# EAGLE design nano_ieee488_v1.0b (EAGLE 6.4)
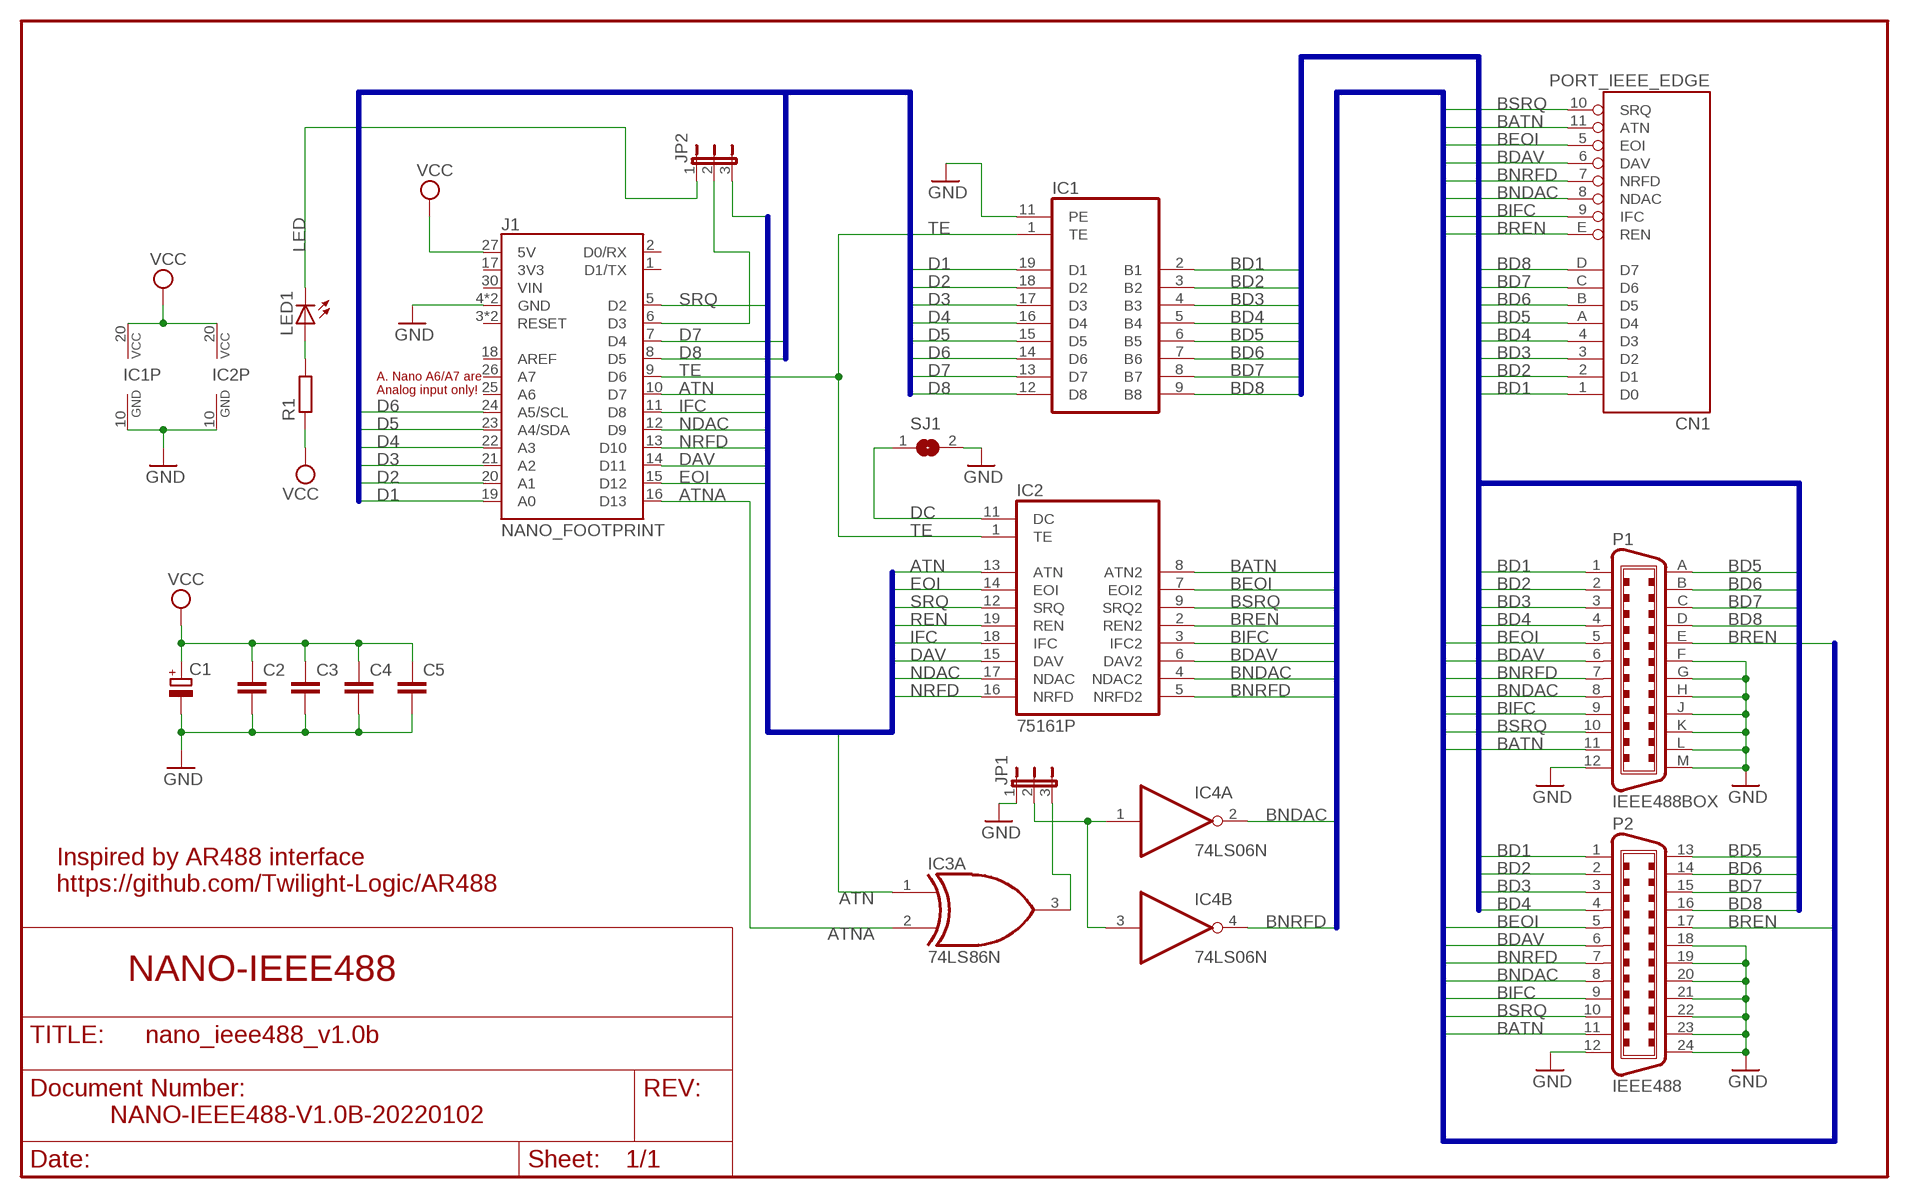
[diagram p0: schematic, sheet 1]

## Parts
C1  CPOL-EUE2.5-7  [E2,5-7]
C2  C-EU025-025X050  [C025-025X050]
C3  C-EU025-025X050  [C025-025X050]
C4  C-EU025-025X050  [C025-025X050]
C5  C-EU025-025X050  [C025-025X050]
CN1  PORT_IEEE_EDGE  [MA156_12-2_IEEE]
IC1  75160P  [DIL20]
IC2  75161P  [DIL20]
IC3  74LS86N  [DIL14]
IC4  74LS06N  [DIL14]
J1  NANO_FOOTPRINT  [NANO]
JP1  JP2E  [JP2]
JP2  JP2E  [JP2]
LED1  LED3MM  [LED3MM]
P1  IEEE488BOX  [FLAT24BOX]
P2  IEEE488  [24HP]
R1  R-EU_0204/5  [0204/5]
SJ1  SJW  [SJW]

## Nets
ATN: IC2.13(ATN) IC3.1(A:I0) J1.10(D7)
ATNA: IC3.2(A:I1) J1.16(D13)
BATN: CN1.11(ATN) IC2.8(ATN2) P1.11 P2.11
BD1: CN1.1(D0) IC1.2(B1) P1.1 P2.1
BD2: CN1.2(D1) IC1.3(B2) P1.2 P2.2
BD3: CN1.3(D2) IC1.4(B3) P1.3 P2.3
BD4: CN1.4(D3) IC1.5(B4) P1.4 P2.4
BD5: CN1.A(D4) IC1.6(B5) P1.A P2.13
BD6: CN1.B(D5) IC1.7(B6) P1.B P2.14
BD7: CN1.C(D6) IC1.8(B7) P1.C P2.15
BD8: CN1.D(D7) IC1.9(B8) P1.D P2.16
BDAV: CN1.6(DAV) IC2.6(DAV2) P1.6 P2.6
BEOI: CN1.5(EOI) IC2.7(EOI2) P1.5 P2.5
BIFC: CN1.9(IFC) IC2.3(IFC2) P1.9 P2.9
BNDAC: CN1.8(NDAC) IC2.4(NDAC2) IC4.2(A:O) P1.8 P2.8
BNRFD: CN1.7(NRFD) IC2.5(NRFD2) IC4.4(B:O) P1.7 P2.7
BREN: CN1.E(REN) IC2.2(REN2) P1.E P2.17
BSRQ: CN1.10(SRQ) IC2.9(SRQ2) P1.10 P2.10
D1: IC1.19(D1) J1.19(A0)
D2: IC1.18(D2) J1.20(A1)
D3: IC1.17(D3) J1.21(A2)
D4: IC1.16(D4) J1.22(A3)
D5: IC1.15(D5) J1.23(A4/SDA)
D6: IC1.14(D6) J1.24(A5/SCL)
D7: IC1.13(D7) J1.7(D4)
D8: IC1.12(D8) J1.8(D5)
DAV: IC2.15(DAV) J1.14(D11)
DC: IC2.11(DC) SJ1.1
EOI: IC2.14(EOI) J1.15(D12)
GND: C1.- C2.2 C3.2 C4.2 C5.2 IC1.10(GND) IC1.11(PE) IC2.10(GND) J1.4(GND) J1.29(GND) JP1.1 P1.12 P1.F P1.G P1.H P1.J P1.K P1.L P1.M P2.12 P2.18 P2.19 P2.20 P2.21 P2.22 P2.23 P2.24 SJ1.2
IFC: IC2.18(IFC) J1.11(D8)
LED: JP2.1 LED1.K(C)
N$1: IC3.3(A:O) JP1.3
N$2: IC4.1(A:I) IC4.3(B:I) JP1.2
N$3: LED1.A R1.2
N$4: J1.6(D3) JP2.2
NDAC: IC2.17(NDAC) J1.12(D9)
NRFD: IC2.16(NRFD) J1.13(D10)
REN: IC2.19(REN) JP2.3
SRQ: IC2.12(SRQ) J1.5(D2)
TE: IC1.1(TE) IC2.1(TE) J1.9(D6)
VCC: C1.+ C2.1 C3.1 C4.1 C5.1 IC1.20(VCC) IC2.20(VCC) J1.27(5V) R1.1
Unconnected: IC3.4(B:I0) IC3.5(B:I1) IC3.6(B:O) IC3.8(C:O) IC3.9(C:I0) IC3.10(C:I1) IC3.11(D:O) IC3.12(D:I0) IC3.13(D:I1) IC4.5(C:I) IC4.6(C:O) IC4.8(D:O) IC4.9(D:I) IC4.10(E:O) IC4.11(E:I) IC4.12(F:O) IC4.13(F:I) J1.1(D1/TX) J1.2(D0/RX) J1.3(RESET) J1.17(3V3) J1.18(AREF) J1.25(A6) J1.26(A7) J1.28(RESET) J1.30(VIN)

## Buses
D[1..8]
ATN,EOI,SRQ,REN,IFC,DAV,NDAC,NRFD
BD[1..8]
BATN,BEOI,BSRQ,BREN,BIFC,BDAV,BNDAC,BNRFD

## Notes on the sheet
- A. Nano A6/A7 are
  Analog input only!
- Inspired by AR488 interface
  https://github.com/Twilight-Logic/AR488
- NANO-IEEE488
- NANO-IEEE488-V1.0B-20220102

## Power pins joined to a net without a drawn wire
GND: CN1.12(GND) CN1.F(GND) CN1.H(GND) CN1.J(GND) CN1.K(GND) CN1.L(GND) CN1.M(GND) CN1.N(GND) IC3.7(P:GND) IC4.7(P:GND)
VCC: IC3.14(P:VCC) IC4.14(P:VCC)

## Library data of the parts
C1 = rcl:CPOL-EU: POLARIZED CAPACITOR, European symbol
C2-C5 = rcl:C-EU: CAPACITOR, European symbol
CN1 = commodore:PORT_IEEE_EDGE: IEEE connector for various Commodore computers, PET/CBM type, edge version
IC1 = 751xx:75160: 75xxx DEVICE
IC2 = 751xx:75161: 75xxx DEVICE
IC3 = 74xx-us:74*86: Quad 2-input EXCLUSIV-OR (XOR) gate
IC4 = 74xx-us:74*06: Hex INVERTER, open collector high-voltage output
J1 = SparkFun-Boards:NANO_FOOTPRINT: Generic Nano Footprint
JP1 JP2 = jumper:JP2E: JUMPER
LED1 = led:LED: LED OSRAM: - CHIPLED LG R971, LG N971, LY N971, LG Q971, LY Q971, LO R971, LY R971 LH N974, LH R974 LS Q976, LO Q976, LY Q976 LO Q996 - Hyper CHIPLED LW Q18S LB Q993, LB Q99A, LB R99A - SideLED LS A670, LO A670, LY A670, LG A670, LP A670 LB A673, LV A673, LT A673, LW A673 LH A674 LY A675 LS A676, LA A676, LO A676, LY A676, LW A676 LS A679, LY A679, LG A679 - Hyper Micro SIDELED® LS Y876, LA Y876, LO Y876, LY Y876 LT Y87S - SmartLED LW L88C, LW L88S LB L89C, LB L89S, LG L890 LS L89K, LO L89K, LY L89K LS L896, LA L896, LO L896, LY L896 - TOPLED LS T670, LO T670, LY T670, LG T670, LP T670 LSG T670, LSP T670, LSY T670, LOP T670, LYG T670 LG T671, LOG T671, LSG T671 LB T673, LV T673, LT T673, LW T673 LH T674 LS T676, LA T676, LO T676, LY T676, LB T676, LH T676, LSB T676, LW T676 LB T67C, LV T67C, LT T67C, LS T67K, LO T67K, LY T67K, LW E67C LS E67B, LA E67B, LO E67B, LY E67B, LB E67C, LV E67C, LT E67C LW T67C LS T679, LY T679, LG T679 LS T770, LO T770, LY T770, LG T770, LP T770 LB T773, LV T773, LT T773, LW T773 LH T774 LS E675, LA E675, LY E675, LS T675 LS T776, LA T776, LO T776, LY T776, LB T776 LHGB T686 LT T68C, LB T68C - Hyper Mini TOPLED® LB M676 - Mini TOPLED Santana® LG M470 LS M47K, LO M47K, LY M47K Source: http://www.osram.convergy.de LUXEON: - LUMILED® LXK2-PW12-R00, LXK2-PW12-S00, LXK2-PW14-U00, LXK2-PW14-V00 LXK2-PM12-R00, LXK2-PM12-S00, LXK2-PM14-U00 LXK2-PE12-Q00, LXK2-PE12-R00, LXK2-PE12-S00, LXK2-PE14-T00, LXK2-PE14-U00 LXK2-PB12-K00, LXK2-PB12-L00, LXK2-PB12-M00, LXK2-PB14-N00, LXK2-PB14-P00, LXK2-PB14-Q00 LXK2-PR12-L00, LXK2-PR12-M00, LXK2-PR14-Q00, LXK2-PR14-R00 LXK2-PD12-Q00, LXK2-PD12-R00, LXK2-PD12-S00 LXK2-PH12-R00, LXK2-PH12-S00 LXK2-PL12-P00, LXK2-PL12-Q00, LXK2-PL12-R00 Source: www.luxeon.com KINGBRIGHT: KA-3528ASYC Source: www.kingbright.com
P1 P2 = csa:IEEE488
R1 = rcl:R-EU_: RESISTOR, European symbol
SJ1 = jumper:SJ: SMD solder JUMPER

## Board
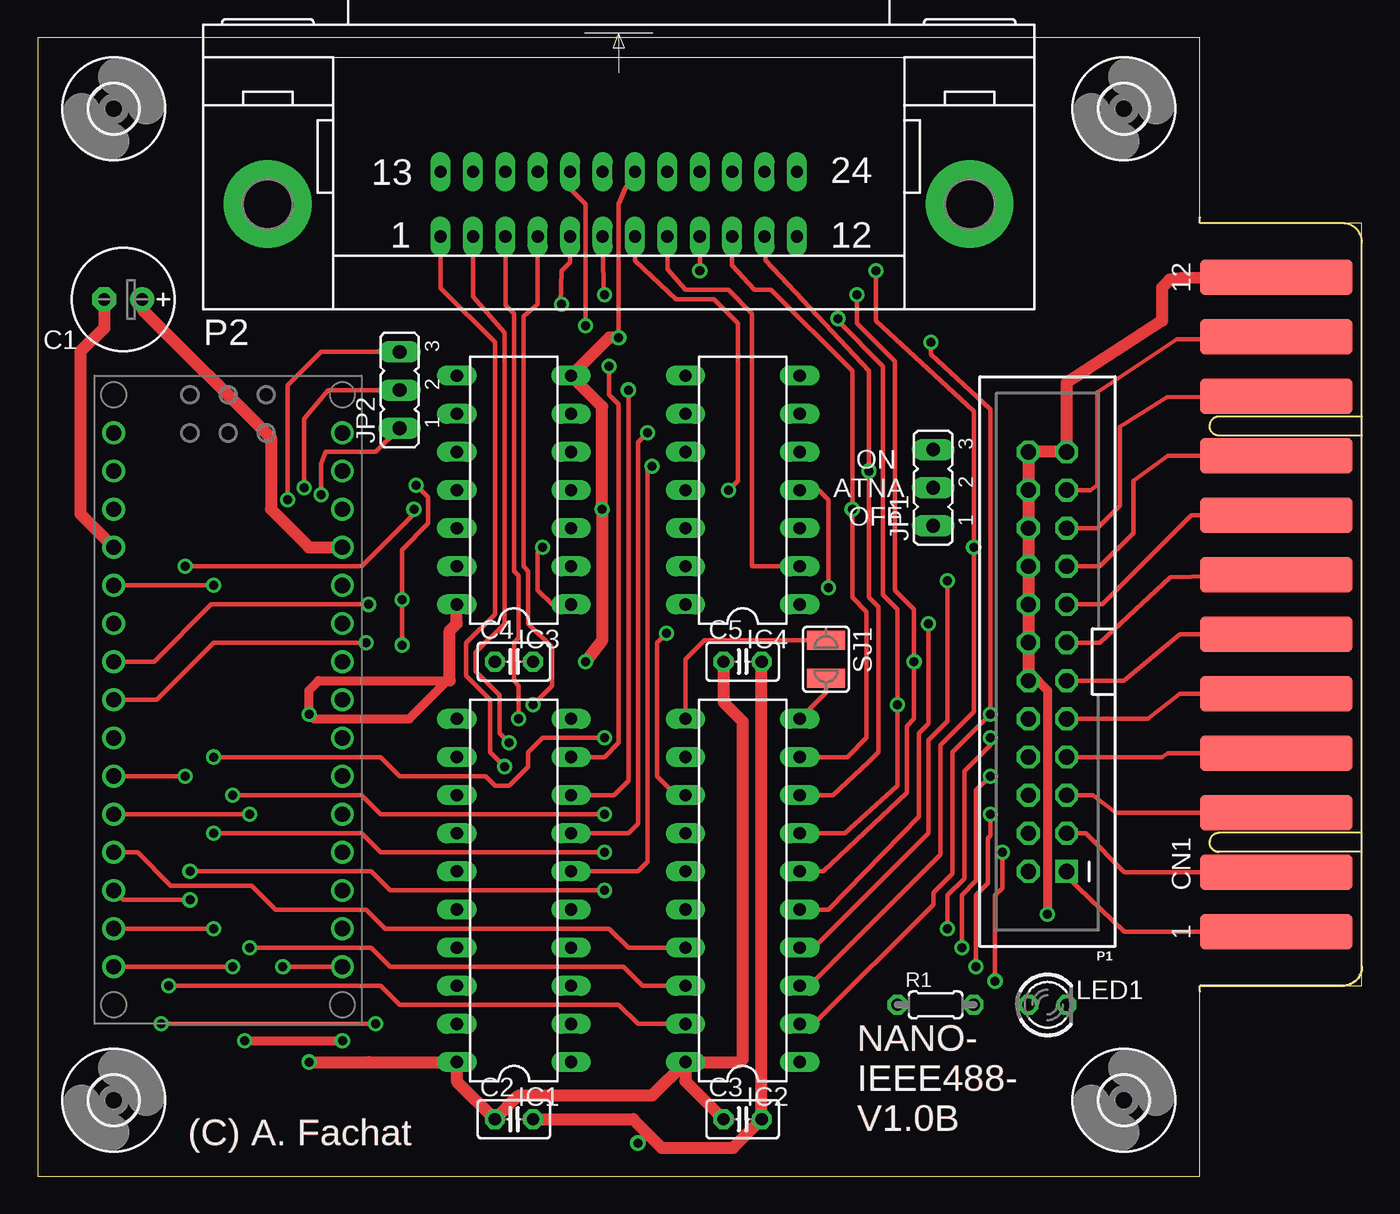
[diagram p1: board, top side]
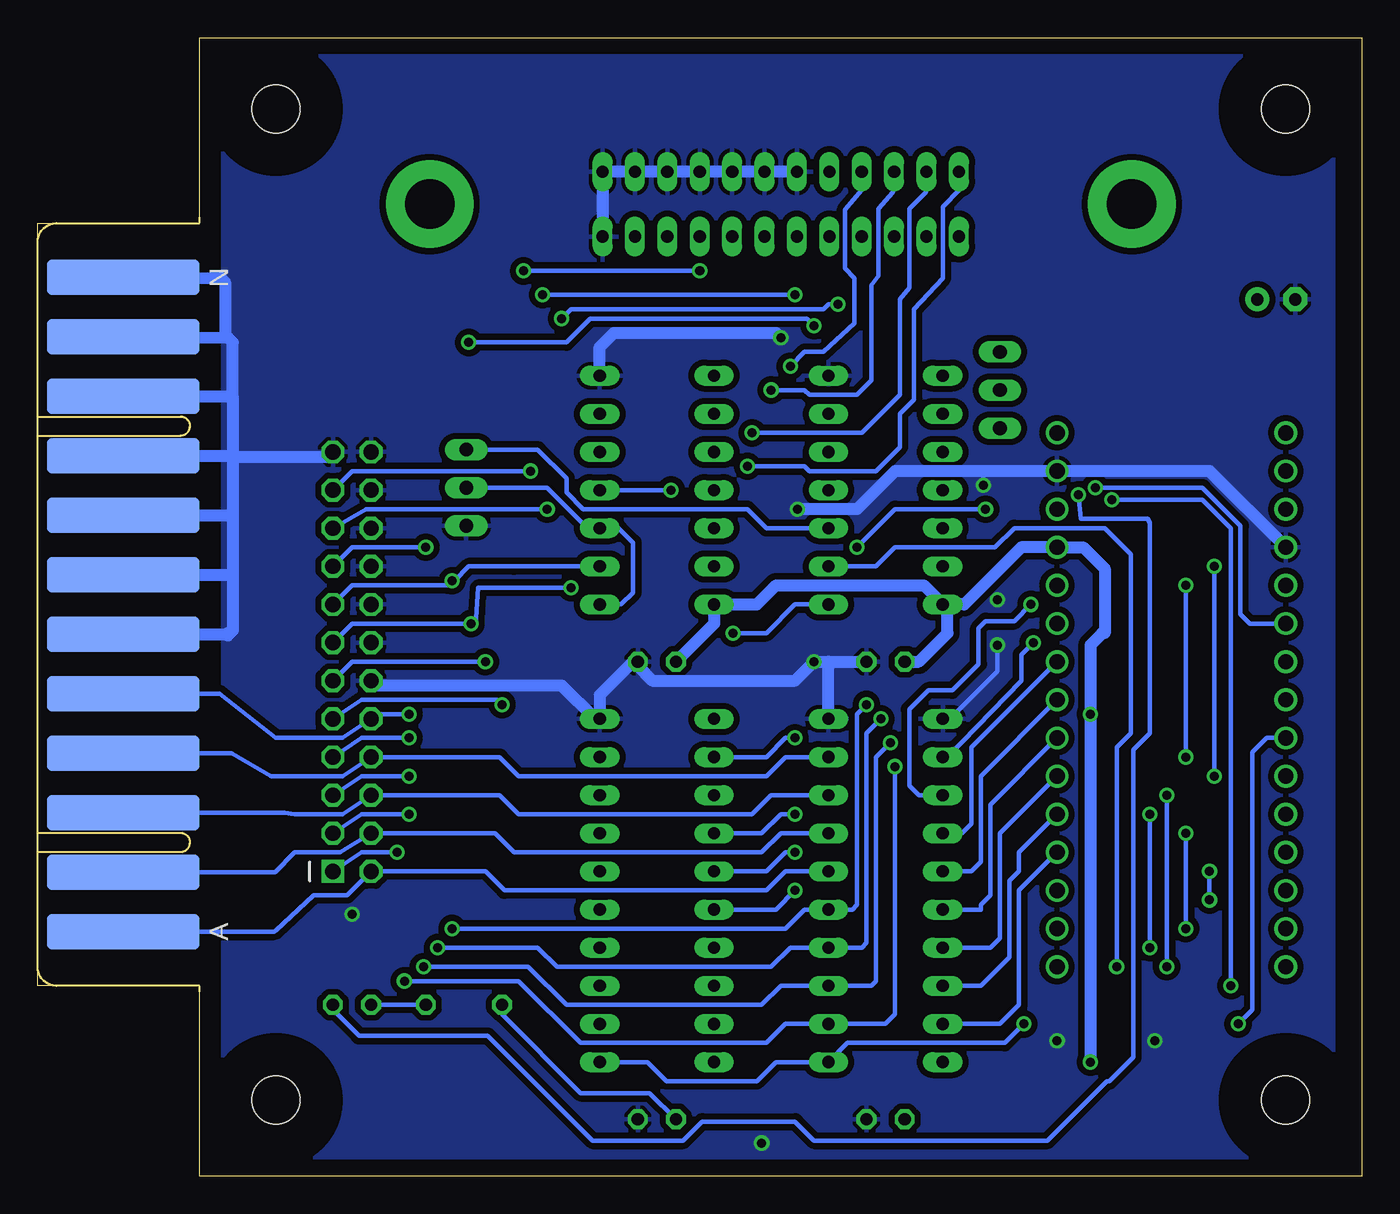
[diagram p2: board, bottom side, seen from below]

Size 88.27 x 75.87 mm. Coordinates in mm from the lower left corner, seen from the top.
Outline: 0,0 77.45,0 77.47,12.54 77.47,12.7 88.27,12.7 88.27,63.5 77.47,63.5 77.47,75.87 0,75.87 0,0
Copper layers (1*16): Top 0.035mm / dielectric 1.5mm / Bottom 0.035mm
Design rules "default *": minimum track width 10mil, minimum drill 12mil, track to track 8mil, track to pad 8mil, pad to pad 8mil, via to via 8mil, smd to smd 8mil, copper to edge 40mil, drill to drill 8mil, minimum pad ring 10mil, minimum via ring 8mil, stop-mask expansion 4mil, vias tented up to drill 0mil, thermal gap 10mil

### Footprints (pad centres in the part's own frame; a part is rotated, then mirrored left to right if it is on the bottom)
E2,5-7 = drill 0.813 pad 1.6: + -1.27,0 | drill 0.813 pad 1.6 octagon: - 1.27,0
C025-025X050 = drill 0.813 octagon: 1 -1.27,0; 2 1.27,0
MA156_12-2_IEEE = smd 2.388 x 10.16: 1 -21.793,0; 2 -17.831,0; 3 -13.868,0; 4 -9.906,0; 5 -5.944,0; 6 -1.981,0; 7 1.981,0; 8 5.944,0; 9 9.906,0; 10 13.868,0; 11 17.831,0; 12 21.793,0 | smd 2.388 x 10.16 bottom: A -21.793,0; B -17.831,0; C -13.868,0; D -9.906,0; E -5.944,0; F -1.981,0; H 1.981,0; J 5.944,0; K 9.906,0; L 13.868,0; M 17.831,0; N 21.793,0
DIL20 = drill 0.813 long: 1 -11.43,-3.81; 2 -8.89,-3.81; 3 -6.35,-3.81; 4 -3.81,-3.81; 5 -1.27,-3.81; 6 1.27,-3.81; 7 3.81,-3.81; 8 6.35,-3.81; 9 8.89,-3.81; 10 11.43,-3.81; 11 11.43,3.81; 12 8.89,3.81; 13 6.35,3.81; 14 3.81,3.81; 15 1.27,3.81; 16 -1.27,3.81; 17 -3.81,3.81; 18 -6.35,3.81; 19 -8.89,3.81; 20 -11.43,3.81
DIL14 = drill 0.813 long: 1 -7.62,-3.81; 2 -5.08,-3.81; 3 -2.54,-3.81; 4 0,-3.81; 5 2.54,-3.81; 6 5.08,-3.81; 7 7.62,-3.81; 8 7.62,3.81; 9 5.08,3.81; 10 2.54,3.81; 11 0,3.81; 12 -2.54,3.81; 13 -5.08,3.81; 14 -7.62,3.81
NANO = drill 1.016: 1 -7.62,17.78; 2 -7.62,15.24; 3 -7.62,12.7; 4 -7.62,10.16; 5 -7.62,7.62; 6 -7.62,5.08; 7 -7.62,2.54; 8 -7.62,0; 9 -7.62,-2.54; 10 -7.62,-5.08; 11 -7.62,-7.62; 12 -7.62,-10.16; 13 -7.62,-12.7; 14 -7.62,-15.24; 15 -7.62,-17.78; 16 7.62,-17.78; 17 7.62,-15.24; 18 7.62,-12.7; 19 7.62,-10.16; 20 7.62,-7.62; 21 7.62,-5.08; 22 7.62,-2.54; 23 7.62,0; 24 7.62,2.54; 25 7.62,5.08; 26 7.62,7.62; 27 7.62,10.16; 28 7.62,12.7; 29 7.62,15.24; 30 7.62,17.78
JP2 = drill 0.914 long: 1 -2.54,0; 2 0,0; 3 2.54,0
LED3MM = drill 0.813 octagon: A -1.27,0; K 1.27,0
FLAT24BOX = drill 1.016 square: 1 -13.97,-1.27 | drill 1.016 octagon: 2 -11.43,-1.27; 3 -8.89,-1.27; 4 -6.35,-1.27; 5 -3.81,-1.27; 6 -1.27,-1.27; 7 1.27,-1.27; 8 3.81,-1.27; 9 6.35,-1.27; 10 8.89,-1.27; 11 11.43,-1.27; 12 13.97,-1.27; A -13.97,1.27; B -11.43,1.27; C -8.89,1.27; D -6.35,1.27; E -3.81,1.27; F -1.27,1.27; G 1.27,1.27; H 3.81,1.27; J 6.35,1.27; K 8.89,1.27; L 11.43,1.27; M 13.97,1.27
24HP = drill 0.813 long: 1 -11.874,-2.159; 2 -9.716,-2.159; 3 -7.556,-2.159; 4 -5.397,-2.159; 5 -3.239,-2.159; 6 -1.079,-2.159; 7 1.079,-2.159; 8 3.239,-2.159; 9 5.397,-2.159; 10 7.556,-2.159; 11 9.716,-2.159; 12 11.874,-2.159; 13 -11.874,2.159; 14 -9.716,2.159; 15 -7.556,2.159; 16 -5.397,2.159; 17 -3.239,2.159; 18 -1.079,2.159; 19 1.079,2.159; 20 3.239,2.159; 21 5.397,2.159; 22 7.556,2.159; 23 9.716,2.159; 24 11.874,2.159 | drill 3.302 pad 5.842: G -23.393,0; G1 23.393,0
0204/5 = drill 0.813 octagon: 1 -2.54,0; 2 2.54,0
SJW = smd 1.27 x 2.54: 1 -1.27,0; 2 1.27,0
3,2 = hole 3.2: 0,0

### Placement (x,y rotation side)
C1  5.71,58.42 180 top
C2  31.75,3.81 0 top
C3  46.99,3.81 0 top
C4  31.75,34.29 0 top
C5  46.99,34.29 0 top
CN1  82.55,38.1 90 top
IC1  31.75,19.05 90 top
IC2  46.99,19.05 90 top
IC3  31.75,45.72 90 top
IC4  46.99,45.72 90 top
J1  12.7,31.75 0 top
JP1  59.69,45.88 90 top
JP2  24.13,52.39 90 top
LED1  67.31,11.43 0 top
P1  67.31,34.29 90 top
P2  38.73,64.77 0 top
R1  59.85,11.43 0 top
SJ1  52.55,34.45 270 top
U$1  [3,2]  5.08,71.12 0 top
U$2  [3,2]  72.39,71.12 0 top
U$3  [3,2]  5.08,5.08 0 top
U$4  [3,2]  72.39,5.08 0 top

### Tracks (layer width: path | path; a pad name or v marks a point on that pad's centre or on a via)
ATN  (via drill 0.6)
  Top 0.305: IC2.13 42.55,25.4 41.27,26.67 41.27,35.56 v41.91,36.2 | IC3.1 34.29,38.1 33.34,39.05 33.34,41.59 v33.66,41.91 | v25.08,44.45 25.08,44.13 21.59,40.64 v9.84,40.64 | v9.84,26.67 J1.10
  Bottom 0.305: v41.91,36.2 39.69,36.2 37.78,38.1 IC3.1 | v33.66,41.91 31.11,44.45 v25.08,44.45 | v9.84,40.64 v9.84,26.67
ATNA  (via drill 0.6)
  Top 0.305: v16.35,13.97 J1.16
  Bottom 0.305: IC3.2 32.38,40.64 31.11,41.91 24.45,41.91 23.18,43.18 17.14,43.18 15.4,41.43 15.4,29.53 16.35,28.57 v16.35,13.97
BATN  (via drill 0.6)
  Top 0.305: CN1.11 78.26,55.88 78.16,55.77 75.93,55.77 70.64,52.23 70.64,46.04 70.17,45.72 P1.11 | IC2.8 53.02,25.4 55.4,27.62 56.04,28.26 56.04,37.94 55.4,38.58 v55.4,46.99 55.4,53.66 48.51,61.02 P2.11
  Bottom 0.305: v55.4,46.99 67.31,46.99 P1.11
BD1  (via drill 0.6)
  Top 0.305: v63.82,13.02 63.82,18.73 64.29,19.21 v64.29,21.59 | P1.1 68.58,20 72.43,16.31 CN1.1 | P2.1 26.86,59.18 30.48,55.56 30.48,37.47 28.57,35.56 28.57,33.34 30.16,31.75 30.16,28.26 v31.11,27.3
  Bottom 0.305: v63.82,13.02 56.2,13.02 52.07,8.89 39.69,8.89 38.42,10.16 IC1.2 31.75,10.16 31.11,10.79 v31.11,27.3 | v64.29,21.59 66.67,21.59 P1.1
BD2  (via drill 0.6)
  Top 0.305: v62.55,13.97 62.55,18.73 63.34,19.53 63.34,22.54 63.5,22.7 v63.5,24.13 | P1.2 69.85,22.86 72.44,20.27 CN1.2 | P2.2 29.02,58.61 31.11,56.2 31.11,36.83 29.21,34.92 29.21,33.66 30.8,32.07 30.8,29.53 v31.43,28.89
  Bottom 0.305: v62.55,13.97 55.56,13.97 53.02,11.43 40.01,11.43 38.73,12.7 IC1.3 32.7,12.7 32.38,13.02 32.38,27.94 v31.43,28.89 | v63.5,24.13 66.67,24.13 P1.2
BD3  (via drill 0.6)
  Top 0.305: v61.59,15.24 61.59,18.73 62.55,19.68 62.55,25.72 v63.5,26.67 | P1.3 70.33,25.4 71.86,24.23 CN1.3 | P2.3 31.18,58.04 31.75,57.47 31.75,40.32 32.07,40.01 32.07,35.88 31.75,35.56 31.75,33.02 32.07,32.7 v32.07,30.48
  Bottom 0.305: v61.59,15.24 54.93,15.24 53.66,13.97 39.37,13.97 38.1,15.24 IC1.4 33.34,15.24 33.02,15.56 33.02,29.53 v32.07,30.48 | v63.5,26.67 66.67,26.67 P1.3
BD4  (via drill 0.6)
  Top 0.305: P1.4 74.93,27.94 75.31,28.19 CN1.4 | v60.64,16.51 60.64,18.73 61.75,19.84 61.75,26.99 63.5,28.73 v63.5,29.21 | P2.4 33.34,58.1 32.38,57.31 32.38,40.64 32.7,40.32 32.7,36.83 34.29,35.24 34.29,32.7 v33.02,31.43
  Bottom 0.305: v60.64,16.51 38.42,16.51 37.15,17.78 IC1.5 33.97,17.78 33.66,18.1 33.66,30.8 v33.02,31.43 | v63.5,29.21 66.67,29.21 P1.4
BD5  (via drill 0.6)
  Top 0.305: IC1.6 40.01,20.32 40.64,20.95 40.64,46.99 v40.96,47.31
  Bottom 0.305: IC1.6 38.42,20.32 39.69,19.05 57.15,19.05 58.42,20.32 P1.A 67.63,18.73 69.85,18.73 72.39,16.35 72.5,16.31 CN1.A | v40.96,47.31 37.15,47.31 36.83,46.99 32.38,46.99 30.8,48.58 30.8,50.8 29.84,51.75 29.84,57.78 27.94,59.85 27.94,64.61 26.83,65.72 P2.13
BD6  (via drill 0.6)
  Top 0.305: IC1.7 39.37,22.86 40.01,23.5 40.01,48.9 v40.64,49.53
  Bottom 0.305: IC1.7 38.73,22.86 40.01,21.59 56.52,21.59 57.78,22.86 P1.B 68.1,21.59 71.12,21.59 72.44,20.27 CN1.B | v40.64,49.53 33.34,49.53 30.8,52.07 30.8,58.42 30.16,59.21 30.16,64.45 29.05,65.56 P2.14
BD7  (via drill 0.6)
  Top 0.305: IC1.8 38.42,25.4 39.37,26.35 v39.37,52.39
  Bottom 0.305: IC1.8 39.37,25.4 40.64,24.13 56.2,24.13 57.47,25.4 P1.C 67.94,24.13 71.12,24.13 71.81,24.23 CN1.C | v39.37,52.39 37.15,52.39 36.83,52.07 33.66,52.07 32.7,53.02 32.7,59.37 32.23,60.01 32.23,64.45 31.27,65.56 31.27,66.83 P2.15
BD8  (via drill 0.6)
  Top 0.305: IC1.9 37.78,27.94 38.73,28.89 38.73,51.44 38.1,52.07 v38.1,53.98
  Bottom 0.305: IC1.9 38.42,27.94 39.69,26.67 56.2,26.67 57.47,27.94 P1.D 67.94,26.67 72.71,26.67 75.31,28.19 CN1.D | v38.1,53.98 37.15,54.93 35.88,54.93 33.81,56.83 33.81,59.85 34.45,60.48 34.45,64.39 33.34,65.72 P2.16
BDAV  (via drill 0.6)
  Top 0.305: CN1.6 76.12,36.12 72.39,33.02 P1.6 | IC2.6 52.39,20.32 57.94,25.56 57.94,30 58.42,30.48 v58.42,34.29 58.42,37.78 57.15,39.05 57.15,54.29 54.61,56.83 v54.61,58.74 | P2.6 37.72,59.44 v37.78,58.74
  Bottom 0.305: v58.42,34.29 67.31,34.29 P1.6 | v37.78,58.74 v54.61,58.74
BEOI  (via drill 0.6)
  Top 0.305: CN1.5 76.11,32.16 73.98,30.48 P1.5 | IC2.7 53.82,22.86 57.31,26.04 v57.31,31.43 57.31,37.78 56.36,38.73 56.36,53.98 53.34,56.99 v53.34,57.15 | P2.5 35.5,60.9 34.92,60.33 34.86,58.17 v34.92,58.1
  Bottom 0.305: v57.31,31.43 57.63,31.75 66.67,31.75 P1.5 | v34.92,58.1 35.56,58.1 35.88,57.78 52.7,57.78 v53.34,57.15
BIFC  (via drill 0.6)
  Top 0.305: CN1.9 75.31,48.01 73.03,46.35 73.03,42.86 70.8,40.64 P1.9 | IC2.3 51.44,12.7 60.17,21.43 60.17,28.73 62.39,30.96 v62.39,41.91 62.39,50.96 55.88,56.99 v55.88,60.33 | P2.9 v44.13,60.33
  Bottom 0.305: v62.39,41.91 67.31,41.91 P1.9 | v44.13,60.33 v55.88,60.33
BNDAC  (via drill 0.6)
  Top 0.305: CN1.8 76.91,44.04 70.96,38.1 P1.8 | IC2.4 51.75,15.24 59.37,22.86 59.37,29.05 60.64,30.32 v60.64,39.69 | P2.8 41.97,60.42 43.18,59.05 46.04,59.05 47.62,57.47 47.62,40.64 IC4.2
  Bottom 0.305: P1.8 67.31,39.37 60.96,39.37 v60.64,39.69 60.48,39.69 59.53,40.64 56.52,40.64 IC4.2
BNRFD  (via drill 0.6)
  Top 0.305: CN1.7 75.48,39.92 70.8,35.56 P1.7 | IC2.5 52.7,17.78 58.74,23.97 58.74,29.53 59.37,30.16 v59.37,36.83 | P2.7 39.81,60.99 42.55,58.42 45.09,58.42 46.67,56.83 46.67,46.35 v46.04,45.72 | IC4.4 52.07,45.72 52.7,45.09 v52.7,39.21
  Bottom 0.305: P1.7 67.31,36.83 v59.37,36.83 59.05,36.67 58.9,39.21 v52.7,39.21 | v46.04,45.72 IC4.4
BREN  (via drill 0.6)
  Top 0.305: IC2.2 51.75,10.16 59.69,18.1 59.69,18.89 60.96,20.16 60.96,28.26 v63.5,30.8 63.5,51.12 59.53,54.77 v59.53,55.56 | P2.17 35.5,65.79 36.51,64.77 v36.51,56.67
  Bottom 0.305: v63.5,30.8 65.72,30.8 P1.E 67.94,29.21 72.39,29.21 76.11,32.16 CN1.E | v36.51,56.67 36.99,57.15 51.44,57.15 53.02,55.56 v59.53,55.56
BSRQ  (via drill 0.6)
  Top 0.305: CN1.10 75.25,51.91 72.13,49.95 72.13,44.67 70.64,43.18 P1.10 | IC2.9 53.98,27.94 55.24,29.21 55.24,37.62 54.29,38.58 v54.29,44.45 54.29,53.66 48.9,59.05 47.78,59.05 46.29,60.71 P2.10
  Bottom 0.305: v54.29,44.45 66.36,44.45 P1.10
D1
  Bottom 0.305: J1.19 22.86,19.05 22.86,11.43 24.13,10.16 IC1.19
D2
  Bottom 0.305: J1.20 22.86,21.59 22.86,20.32 23.5,19.68 23.5,14.61 25.4,12.7 IC1.18
D3
  Bottom 0.305: J1.21 24.13,22.86 24.13,15.88 24.77,15.24 IC1.17
D4
  Bottom 0.305: J1.22 24.77,24.77 24.77,18.73 25.4,18.1 25.4,17.78 IC1.16
D5
  Bottom 0.305: J1.23 25.4,26.67 25.4,20.95 26.04,20.32 IC1.15
D6
  Bottom 0.305: J1.24 26.04,28.57 26.04,23.5 26.67,22.86 IC1.14
D7  (via drill 0.6)
  Top 0.305: v22.07,38.1 11.59,38.1 7.78,34.29 J1.7
  Bottom 0.305: IC1.13 29.53,25.4 30.16,26.04 30.16,31.11 28.89,32.38 27.3,32.38 25.56,34.13 25.56,36.51 25.08,36.99 23.18,36.99 v22.07,38.1
D8  (via drill 0.6)
  Top 0.305: v21.91,35.56 11.75,35.56 7.94,31.75 J1.8
  Bottom 0.305: IC1.12 27.62,27.94 22.7,33.02 22.7,34.77 v21.91,35.56
DAV  (via drill 0.6)
  Top 0.305: v37.78,21.59 22.86,21.59 21.59,22.86 v11.75,22.86 | v11.75,16.51 J1.14
  Bottom 0.305: IC2.15 39.69,20.32 38.42,21.59 v37.78,21.59 | v11.75,22.86 v11.75,16.51
DC
  Top 0.305: SJ1.1 44.45,35.72 43.18,34.45 IC2.11
EOI  (via drill 0.6)
  Top 0.305: v37.78,24.13 22.86,24.13 21.59,25.4 v13.02,25.4 | v13.02,13.97 J1.15
  Bottom 0.305: IC2.14 40.01,22.86 38.73,24.13 v37.78,24.13 | v13.02,25.4 v13.02,13.97
GND  (via drill 0.6)
  Top 0.305: 75.77,59.8 75.45,59.73 | v38.73,55.88 38.73,64.77 39.18,65.85 P2.19 | v24.29,35.4 v24.29,38.42 24.29,41.75 26.04,43.5 26.04,45.24 v25.24,46.04 | SJ1.2 52.55,32.23 IC2.10
  Top 0.61: P1.F 66.67,33.02 67.31,32.38 v67.31,17.46 | v13.81,9.05 v20.32,9.05 | 40.64,2.86 v40.01,2.22
  Top 0.813: CN1.12 76.2,59.85 75.77,59.8 | 75.45,59.73 74.93,59.21 74.93,56.99 68.58,52.86 P1.12 P1.M P1.L P1.K P1.J P1.H P1.G P1.F | v36.51,34.29 37.62,35.72 v37.62,44.45 37.62,51.28 IC3.7 38.1,55.88 v38.73,55.88 | C2.2 39.69,3.81 40.64,2.86 41.59,1.91 46.35,1.91 C3.2 C5.2 | C1.- 4.45,56.52 2.86,54.93 2.86,44.13 J1.4
  Bottom 0.305: 75.25,48.26 74.93,47.94 75.25,47.94 75.31,48.01 | 75.56,55.88 75.3,55.61 | 75.25,55.56 75.25,52.17 75.3,52.12 75.25,52.07 75.25,51.91 75.31,51.97 | C5.2 48.26,33.97 | 75.33,40.08 75.25,40.16 | 75.34,44.04 75.25,44.13 | IC1.11 27.46,30.48 24.29,33.66 v24.29,35.4 | v25.24,46.04 25.24,46.83 25.4,46.99
  Bottom 0.813: P1.F 65.72,32.7 53.34,32.7 51.12,30.48 IC2.10 50.8,32.07 48.58,34.29 C5.2 | 74.93,47.94 68.9,47.94 P1.12 | CN1.H 75.33,40.08 75.25,40.08 75.25,36.35 75.56,36.04 75.56,36.2 75.64,36.12 CN1.F | CN1.M 75.56,55.88 | 75.3,55.61 75.3,52.12 | 75.25,51.91 75.25,48.26 | CN1.12 76.04,59.85 75.77,59.58 75.77,56.08 75.25,55.56 | v37.62,44.45 33.66,44.45 31.11,46.99 25.4,46.99 J1.29 10.16,46.99 J1.4 | 35.56,34.29 v36.51,34.29 37.78,33.02 47.31,33.02 48.26,33.97 | 35.56,34.29 C4.2 | IC1.10 35.56,34.29 | P2.18 P2.19 P2.20 P2.21 P2.22 P2.23 P2.24 P2.12 | IC4.7 50.8,55.24 49.85,56.2 39.05,56.2 v38.73,55.88 | 75.25,47.94 75.25,44.13 75.25,40.16 | CN1.J 75.34,44.04 | CN1.K 75.31,48.01 | CN1.L 75.31,51.97
  pour Bottom (isolate 0.406): 1.91,74.61 75.88,74.61 75.88,1.27 1.91,1.27
IFC  (via drill 0.6)
  Top 0.305: IC2.18 40.32,12.7 39.05,13.97 23.5,13.97 22.23,15.24 v14.13,15.24 | v14.13,24.13 J1.11
  Bottom 0.305: v14.13,15.24 v14.13,24.13
LED  (via drill 0.6)
  Top 0.305: v18.89,45.4 18.89,47.47 19.21,48.26 22.54,48.26 JP2.1
  Bottom 0.305: LED1.K 68.58,11.11 66.83,9.37 58.26,9.37 51.28,2.38 45.24,2.38 43.97,3.65 37.78,3.65 36.51,2.38 20.95,2.38 16.99,6.35 16.83,6.35 15.24,7.94 15.24,28.42 14.13,29.53 14.13,43.5 14.29,43.81 18.73,43.81 v18.89,45.4
N$1
  Bottom 0.305: IC3.3 39.69,43.18 40.96,44.45 51.91,44.45 53.02,45.56 53.02,46.51 54.93,48.42 JP1.3
N$2
  Bottom 0.305: JP1.2 54.29,45.88 51.59,43.18 IC4.3 49.53,43.18 48.58,42.23 48.58,38.89 49.37,38.1 IC4.1
N$3
  Bottom 0.305: R1.2 LED1.A
N$4  (via drill 0.6)
  Top 0.305: v17.78,45.88 17.78,50.48 19.37,52.39 JP2.2
  Bottom 0.305: J1.6 7.46,36.83 8.1,37.47 8.1,43.34 10.64,45.88 v17.78,45.88
NDAC
  Top 0.305: IC2.17 39.37,15.24 38.1,16.51 23.18,16.51 21.91,17.78 15.88,17.78 14.29,19.37 8.89,19.37 6.67,21.59 J1.12
NRFD  (via drill 0.6)
  Top 0.305: v37.78,19.05 23.5,19.05 22.23,20.32 v10.16,20.32 | v10.16,18.41 5.71,18.41 J1.13
  Bottom 0.305: IC2.16 39.05,17.78 v37.78,19.05 | v10.16,20.32 v10.16,18.41
REN  (via drill 0.6)
  Top 0.305: IC2.19 40.01,10.16 38.73,11.43 24.13,11.43 22.86,12.7 v8.73,12.7 | v16.67,45.09 16.67,52.7 18.89,54.93 JP2.3
  Bottom 0.305: v8.73,12.7 8.73,43.18 10.64,45.09 v16.67,45.09
SRQ  (via drill 0.6)
  Top 0.305: v37.78,29.21 33.66,29.21 32.7,28.26 32.7,27.3 31.43,26.04 30.48,26.04 29.84,26.67 24.13,26.67 22.86,27.94 v11.75,27.94 | v11.75,39.37 J1.5
  Bottom 0.305: IC2.12 39.69,27.94 38.42,29.21 v37.78,29.21 | v11.75,27.94 v11.75,39.37
TE  (via drill 0.6)
  Top 0.305: v8.26,10.16 v22.54,10.16
  Bottom 0.305: J1.9 6.35,29.21 7.3,28.26 7.3,11.11 v8.26,10.16 | v22.54,10.16 23.81,8.89 34.29,8.89 IC1.1 39.05,7.62 40.32,6.35 46.35,6.35 47.62,7.62 IC2.1
VCC  (via drill 0.6)
  Top 0.305: 21.91,7.46 22.07,7.62
  Top 0.61: 27.3,33.02 18.73,33.02 18.1,32.38 v18.1,30.8 18.41,30.48 24.77,30.48 27.3,33.02 | 27.3,33.02 27.46,33.02
  Top 0.813: IC2.20 40.96,5.4 32.07,5.4 C2.1 27.94,6.35 IC1.20 22.07,7.62 v18.1,7.62 | IC2.20 43.18,6.35 C3.1 | 27.46,33.02 27.46,36.35 27.94,36.83 IC3.14 | C1.+ 6.99,57.78 15.56,49.21 15.56,44.45 18.1,41.91 J1.27 | C5.1 45.72,31.59 46.99,30.32 46.99,7.78 46.83,7.62 IC2.20
  Bottom 0.305: 27.62,37.78 IC3.14 | R1.1 57.31,10.79 52.07,5.56 47.47,5.56 C3.1
  Bottom 0.813: C4.1 29.53,34.29 27.62,36.2 27.62,37.78 | C5.1 43.18,36.83 IC4.14 40.32,38.1 39.05,39.37 29.21,39.37 IC3.14 26.51,38.1 22.7,41.91 J1.27 18.57,41.91 17.14,40.48 17.14,36.2 17.3,36.2 18.1,35.4 v18.1,30.8 v18.1,7.62

### Text on the board
Top: NANO- / IEEE488- / V1.0B | (C) A. Fachat
tNames: ON / ATNA / OFF | NANO- / IEEE488- / V1.0B | (C) A. Fachat